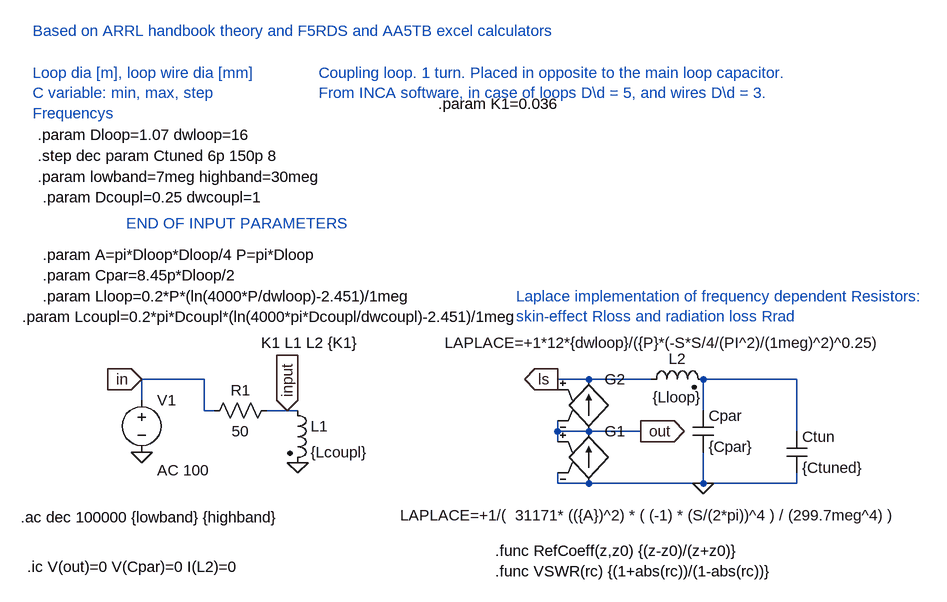
[diagram p0: schematic mag_loop.asc]
mag_loop.asc, the LTspice schematic file:
Version 4
SHEET 1 1684 920
WIRE 32 80 -64 80
WIRE 624 80 576 80
WIRE 720 80 624 80
WIRE 944 80 800 80
WIRE 576 96 576 80
WIRE -64 112 -64 80
WIRE 32 128 32 80
WIRE 48 128 32 128
WIRE 160 128 128 128
WIRE 176 128 160 128
WIRE 800 128 800 80
WIRE 576 160 576 144
WIRE 624 160 576 160
WIRE 704 160 624 160
WIRE 944 160 944 80
WIRE 576 176 576 160
WIRE 576 240 576 224
WIRE 624 240 576 240
WIRE 800 240 800 192
WIRE 800 240 624 240
WIRE 944 240 944 224
WIRE 944 240 800 240
FLAG 176 208 0
FLAG -64 192 0
FLAG 800 240 0
FLAG 704 160 out
IOPIN 704 160 Out
FLAG -64 80 in
IOPIN -64 80 In
FLAG 576 80 ls
IOPIN 576 80 Out
FLAG 160 128 input
IOPIN 160 128 In
SYMBOL ind2 160 112 R0
SYMATTR InstName L1
SYMATTR Value {Lcoupl}
SYMATTR Type ind
SYMBOL ind2 704 96 R270
WINDOW 0 32 56 VTop 2
WINDOW 3 4 56 VBottom 2
SYMATTR InstName L2
SYMATTR Value {Lloop}
SYMATTR Type ind
SYMBOL cap 928 160 R0
SYMATTR InstName Ctun
SYMATTR Value {Ctuned}
SYMBOL voltage -64 96 R0
WINDOW 3 24 152 Left 2
WINDOW 123 24 124 Left 2
WINDOW 39 24 152 Left 2
SYMATTR InstName V1
SYMATTR Value ""
SYMATTR Value2 AC 100
SYMBOL cap 784 128 R0
SYMATTR InstName Cpar
SYMATTR Value {Cpar}
SYMBOL res 144 112 R90
WINDOW 0 0 56 VBottom 2
WINDOW 3 32 56 VTop 2
SYMATTR InstName R1
SYMATTR Value 50
SYMBOL g 624 144 R0
WINDOW 3 -290 145 Left 2
SYMATTR InstName G1
SYMATTR Value LAPLACE=+1/(  31171* (({A})^2) * ( (-1) * (S/(2*pi))^4 ) / (299.7meg^4) )
SYMBOL g 624 64 R0
WINDOW 3 -222 -40 Left 2
SYMATTR InstName G2
SYMATTR Value LAPLACE=+1*12*{dwloop}/({P}*(-S*S/4/(PI^2)/(1meg)^2)^0.25)
TEXT 120 24 Left 2 !K1 L1 L2 {K1}
TEXT -250 292 Left 2 !.ac dec 100000 {lowband} {highband}
TEXT -224 -264 Left 2 !.step dec param Ctuned 6p 150p 8
TEXT -224 -296 Left 2 !.param Dloop=1.07 dwloop=16
TEXT -224 -232 Left 2 !.param lowband=7meg highband=30meg
TEXT -232 -392 Left 2 ;Loop dia [m], loop wire dia [mm]\nC variable: min, max, step\nFrequencys
TEXT -216 -112 Left 2 !.param A=pi*Dloop*Dloop/4 P=pi*Dloop
TEXT 392 -344 Left 2 !.param K1=0.036
TEXT 208 -392 Left 2 ;Coupling loop. 1 turn. Placed in opposite to the main loop capacitor.\nFrom INCA software, in case of loops D\\d = 5, and wires D\\d = 3.
TEXT -216 -80 Left 2 !.param Cpar=8.45p*Dloop/2
TEXT -240 368 Left 2 !.ic V(out)=0 V(Cpar)=0 I(L2)=0
TEXT 512 -48 Left 2 ;Laplace implementation of frequency dependent Resistors:\nskin-effect Rloss and radiation loss Rrad
TEXT -232 -456 Left 2 ;Based on ARRL handbook theory and F5RDS and AA5TB excel calculators
TEXT 480 344 Left 2 !.func RefCoeff(z,z0) {(z-z0)/(z+z0)}\n.func VSWR(rc) {(1+abs(rc))/(1-abs(rc))}
TEXT -216 -48 Left 2 !.param Lloop=0.2*P*(ln(4000*P/dwloop)-2.451)/1meg
TEXT -88 -160 Left 2 ;END OF INPUT PARAMETERS
TEXT -248 -16 Left 2 !.param Lcoupl=0.2*pi*Dcoupl*(ln(4000*pi*Dcoupl/dwcoupl)-2.451)/1meg
TEXT -216 -200 Left 2 !.param Dcoupl=0.25 dwcoupl=1

The netlist it stands for:
* mag_loop.asc
L1 input 0 {Lcoupl}
L2 ls N001 {Lloop}
Ctun N001 0 {Ctuned}
V1 in 0 AC 100
Cpar N001 0 {Cpar}
R1 input in 50
G1 0 out out 0 LAPLACE=+1/(  31171* (({A})^2) * ( (-1) * (S/(2*pi))^4 ) / (299.7meg^4) )
G2 out ls ls out LAPLACE=+1*12*{dwloop}/({P}*(-S*S/4/(PI^2)/(1meg)^2)^0.25)
K1 L1 L2 {K1}
.ac dec 100000 {lowband} {highband}
.step dec param Ctuned 6p 150p 8
.param Dloop=1.07 dwloop=16
.param lowband=7meg highband=30meg
* Loop dia [m], loop wire dia [mm]
* C variable: min, max, step
* Frequencys
.param A=pi*Dloop*Dloop/4 P=pi*Dloop
.param K1=0.036
* Coupling loop. 1 turn. Placed in opposite to the main loop capacitor.
* From INCA software, in case of loops D\d = 5, and wires D\d = 3.
.param Cpar=8.45p*Dloop/2
.ic V(out)=0 V(Cpar)=0 I(L2)=0
* Laplace implementation of frequency dependent Resistors:
* skin-effect Rloss and radiation loss Rrad
* Based on ARRL handbook theory and F5RDS and AA5TB excel calculators
.func RefCoeff(z,z0) {(z-z0)/(z+z0)}
.func VSWR(rc) {(1+abs(rc))/(1-abs(rc))}
.param Lloop=0.2*P*(ln(4000*P/dwloop)-2.451)/1meg
* END OF INPUT PARAMETERS
.param Lcoupl=0.2*pi*Dcoupl*(ln(4000*pi*Dcoupl/dwcoupl)-2.451)/1meg
.param Dcoupl=0.25 dwcoupl=1
.backanno
.end